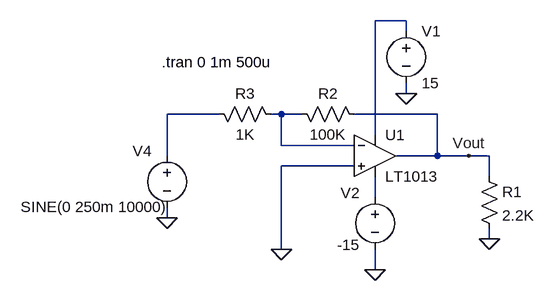
[diagram p0: schematic Opamp GBP.asc]
Opamp GBP.asc, the LTspice schematic file:
Version 4
SHEET 1 880 680
WIRE 288 -64 240 -64
WIRE 288 -48 288 -64
WIRE 288 48 288 32
WIRE 0 80 -80 80
WIRE 96 80 80 80
WIRE 128 80 96 80
WIRE 336 80 208 80
WIRE 240 112 240 -64
WIRE 96 128 96 80
WIRE 208 128 96 128
WIRE -80 144 -80 80
WIRE 336 144 336 80
WIRE 336 144 272 144
WIRE 384 144 336 144
WIRE 416 144 384 144
WIRE 208 160 96 160
WIRE 416 176 416 144
WIRE 240 208 240 176
WIRE -80 240 -80 224
WIRE 416 272 416 256
WIRE 96 288 96 160
WIRE 240 320 240 288
FLAG 288 48 0
FLAG 240 320 0
FLAG 384 144 Vout
FLAG 416 272 0
FLAG -80 240 0
FLAG 96 288 0
SYMBOL Opamps\\LT1013 240 80 R0
SYMATTR InstName U1
SYMBOL voltage 288 -64 R0
WINDOW 123 0 0 Left 2
WINDOW 39 0 0 Left 2
SYMATTR InstName V1
SYMATTR Value 15
SYMBOL res 400 160 R0
SYMATTR InstName R1
SYMATTR Value 2.2K
SYMBOL voltage -80 128 R0
WINDOW 0 -53 9 Left 2
WINDOW 3 -225 95 Left 2
WINDOW 123 0 0 Left 2
WINDOW 39 0 0 Left 2
SYMATTR InstName V4
SYMATTR Value SINE(0 250m 10000)
SYMBOL voltage 240 192 R0
WINDOW 0 -53 9 Left 2
WINDOW 3 -58 89 Left 2
WINDOW 123 0 0 Left 2
WINDOW 39 0 0 Left 2
SYMATTR InstName V2
SYMATTR Value -15
SYMBOL res 112 64 M90
WINDOW 0 0 56 VBottom 2
WINDOW 3 32 56 VTop 2
SYMATTR InstName R2
SYMATTR Value 100K
SYMBOL res -16 64 M90
WINDOW 0 0 56 VBottom 2
WINDOW 3 32 56 VTop 2
SYMATTR InstName R3
SYMATTR Value 1K
TEXT -88 0 Left 2 !.tran 0 1m 500u

The netlist it stands for:
* Opamp GBP.asc
XU1 0 N003 N001 N004 Vout LT1013  ; pins In+ In- V+ V- OUT
V1 N001 0 15
R1 Vout 0 2.2K
V4 N002 0 SINE(0 250m 10000)
V2 N004 0 -15
R2 N003 Vout 100K
R3 N002 N003 1K
.tran 0 1m 500u
.lib LTC.lib
.backanno
.end